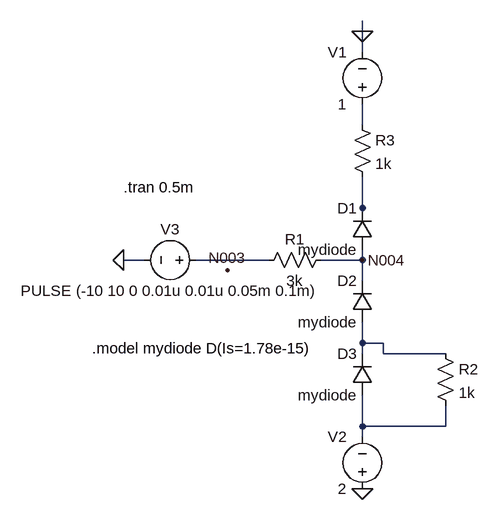
[diagram p0: schematic Draft10.asc]
Draft10.asc, the LTspice schematic file:
Version 4
SHEET 1 880 768
WIRE 368 48 368 32
WIRE 368 80 368 48
WIRE 368 192 368 160
WIRE 368 320 368 272
WIRE 368 336 368 320
WIRE 32 400 0 400
WIRE 224 400 112 400
WIRE 368 400 368 384
WIRE 368 400 304 400
WIRE 368 432 368 400
WIRE 368 528 368 496
WIRE 400 528 368 528
WIRE 368 544 368 528
WIRE 400 544 400 528
WIRE 496 544 400 544
WIRE 368 656 368 608
WIRE 496 656 496 624
WIRE 496 656 368 656
WIRE 368 672 368 656
FLAG 0 400 0
FLAG 368 48 0
FLAG 368 752 0
FLAG 368 400 N004
FLAG 160 416 N003
SYMBOL res 320 384 R90
WINDOW 0 0 56 VBottom 2
WINDOW 3 32 56 VTop 2
SYMATTR InstName R1
SYMATTR Value 3k
SYMBOL diode 384 384 R180
WINDOW 0 24 64 Left 2
WINDOW 3 24 0 Left 2
SYMATTR InstName D1
SYMATTR Value mydiode
SYMBOL diode 384 496 R180
WINDOW 0 24 64 Left 2
WINDOW 3 24 0 Left 2
SYMATTR InstName D2
SYMATTR Value mydiode
SYMBOL diode 384 608 R180
WINDOW 0 24 64 Left 2
WINDOW 3 24 0 Left 2
SYMATTR InstName D3
SYMATTR Value mydiode
SYMBOL voltage 368 176 R180
WINDOW 0 24 96 Left 2
WINDOW 3 24 16 Left 2
SYMATTR InstName V1
SYMATTR Value 1
SYMBOL voltage 368 768 R180
WINDOW 0 24 96 Left 2
WINDOW 3 24 16 Left 2
SYMATTR InstName V2
SYMATTR Value 2
SYMBOL res 480 528 R0
SYMATTR InstName R2
SYMATTR Value 1k
SYMBOL res 352 176 R0
SYMATTR InstName R3
SYMATTR Value 1k
SYMBOL voltage 128 400 R90
WINDOW 0 -32 56 VBottom 2
WINDOW 3 32 56 VTop 2
SYMATTR InstName V3
SYMATTR Value PULSE (-10 10 0 0.01u 0.01u 0.05m 0.1m)
TEXT -48 536 Left 2 !.model mydiode D(Is=1.78e-15)
TEXT 0 288 Left 2 !.tran 0.5m

The netlist it stands for:
* Draft10.asc
R1 N004 N005 3k
D1 N004 N002 mydiode
D2 N006 N004 mydiode
D3 N007 N006 mydiode
V1 N001 0 1
V2 0 N007 2
R2 N006 N007 1k
R3 N001 N002 1k
V3 N005 0 PULSE (-10 10 0 0.01u 0.01u 0.05m 0.1m)
.model D D
.lib standard.dio
.model mydiode D(Is=1.78e-15)
.tran 0.5m
.backanno
.end